# Altium schematic sheet Connectors.SchDoc
size A4; SheetNumber: 1; SheetTotal: 3
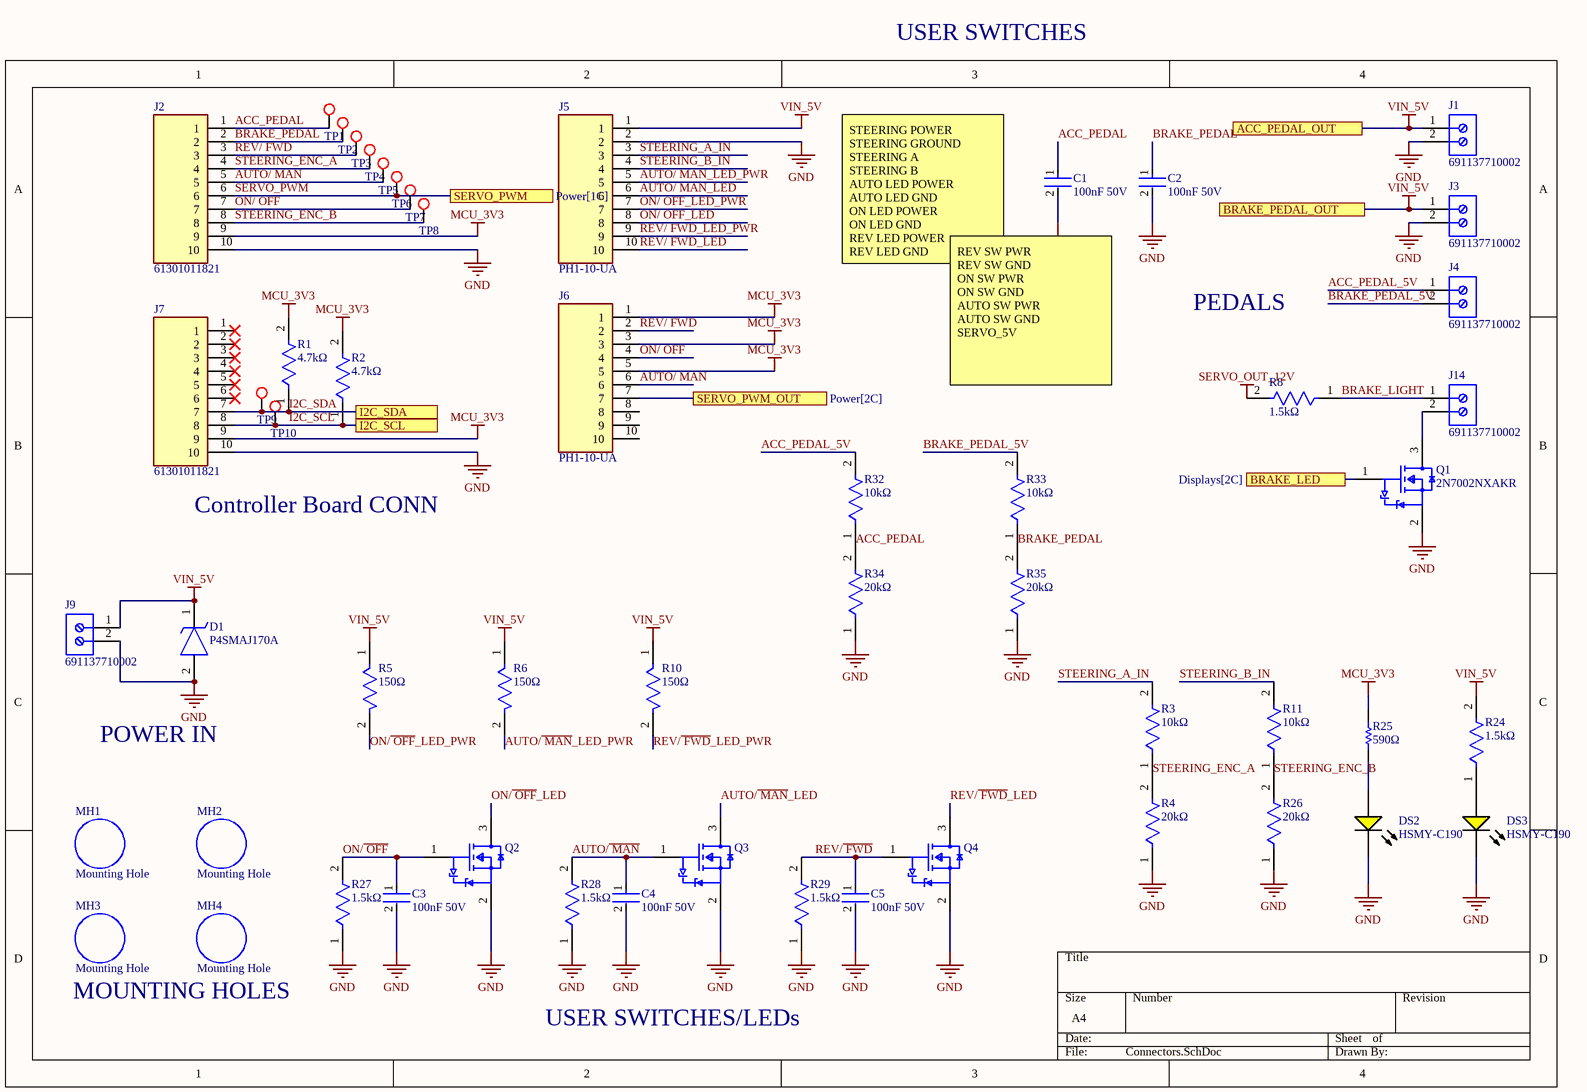
[diagram p0: Connectors.SchDoc]

## Parts
C1  100nF 50V  [FP-CL31-IPC_C]
C2  100nF 50V  [FP-CL31-IPC_C]
C3  100nF 50V  [FP-CL31-IPC_C]
C4  100nF 50V  [FP-CL31-IPC_C]
C5  100nF 50V  [FP-CL31-IPC_C]
D1  P4SMAJ170A  [DIOM5027X240N]
DS2  HSMY-C190  [AVAG-HSMX-C190_V]
DS3  HSMY-C190  [AVAG-HSMX-C190_V]
J1  691137710002  [691137710002]
J2  61301011821  [RHDR10W60P0X254_1X10_2590X250X850P]
J3  691137710002  [691137710002]
J4  691137710002  [691137710002]
J5  PH1-10-UA  [HDRV10W64P0X254_1X10_2540X249X886P]
J6  PH1-10-UA  [HDRV10W64P0X254_1X10_2540X249X886P]
J7  61301011821  [RHDR10W60P0X254_1X10_2590X250X850P]
J9  691137710002  [691137710002]
J14  691137710002  [691137710002]
MH1  Mounting Hole  [Mounting Hole]
MH2  Mounting Hole  [Mounting Hole]
MH3  Mounting Hole  [Mounting Hole]
MH4  Mounting Hole  [Mounting Hole]
Q1  2N7002NXAKR  [FP-SOT23-IPC_B]
Q2  2N7002NXAKR  [FP-SOT23-IPC_B]  (value not drawn)
Q3  2N7002NXAKR  [FP-SOT23-IPC_B]  (value not drawn)
Q4  2N7002NXAKR  [FP-SOT23-IPC_B]  (value not drawn)
R1  4.7kΩ  [FP-RT0805-MFG]
R2  4.7kΩ  [FP-RT0805-MFG]
R3  10kΩ  [FP-RT0603-MFG]
R4  20kΩ  [FP-RT0805-MFG]
R5  150Ω  [FP-RT0603-MFG]
R6  150Ω  [FP-RT0603-MFG]
R8  1.5kΩ  [FP-CRCW0603-e3-IPC_A]  (no BOM)
R10  150Ω  [FP-RT0603-MFG]
R11  10kΩ  [FP-RT0603-MFG]
R24  1.5kΩ  [FP-RC1608-IPC_B]
R25  590Ω  [RESC1608X55X25ML10T15]
R26  20kΩ  [FP-RT0805-MFG]
R27  1.5kΩ  [FP-CRCW0603-e3-IPC_A]
R28  1.5kΩ  [FP-CRCW0603-e3-IPC_A]
R29  1.5kΩ  [FP-CRCW0603-e3-IPC_A]
R32  10kΩ  [FP-RT0603-MFG]
R33  10kΩ  [FP-RT0603-MFG]
R34  20kΩ  [FP-RT0805-MFG]
R35  20kΩ  [FP-RT0805-MFG]
TP1  TP  [Testpoint]  (value not drawn)
TP2  TP  [Testpoint]  (value not drawn)
TP3  TP  [Testpoint]  (value not drawn)
TP4  TP  [Testpoint]  (value not drawn)
TP5  TP  [Testpoint]  (value not drawn)
TP6  TP  [Testpoint]  (value not drawn)
TP7  TP  [Testpoint]  (value not drawn)
TP8  TP  [Testpoint]  (value not drawn)
TP9  TP  [Testpoint]  (value not drawn)
TP10  TP  [Testpoint]  (value not drawn)

## Ports
ACC_PEDAL_OUT, BRAKE_LED (see Displays[2C]), BRAKE_PEDAL_OUT, I2C_SCL (see Displays[1A], Displays[2C]), I2C_SDA (see Displays[1A], Displays[2C]), SERVO_PWM (see Power[1C]), SERVO_PWM_OUT (see Power[2C])

## Nets
GND: C1.2 C2.2 C3.2 C4.2 C5.2 D1.2(A) DS2.2(K) DS3.2(K) J1.2 J2.10 J3.2 J5.2 J7.10 J9.2 Q1.2(S) Q2.2(S) Q3.2(S) Q4.2(S) R4.1 R26.1 R27.1 R28.1 R29.1 R34.1 R35.1
MCU_3V3: J2.9 J6.1 J6.3 J6.5 J7.9 R1.2 R2.2 R25.2
SERVO_OUT_12V: R8.2
VIN_5V: D1.1(K) J1.1 J3.1 J5.1 J9.1 R5.1 R6.1 R10.1 R24.2 ; port ACC_PEDAL_OUT, port BRAKE_PEDAL_OUT
ACC_PEDAL: C1.1 J2.1 R32.1 R34.2 TP1.0
ACC_PEDAL_5V: J4.1 R32.2
AUTO/~{ MAN}: C4.1 J2.5 J6.6 Q3.1(G) R28.2 TP5.0
AUTO/~{ MAN}_LED: J5.6 Q3.3(D)
AUTO/~{ MAN}_LED_PWR: J5.5 R6.2
BRAKE_LED: Q1.1(G) ; port BRAKE_LED
BRAKE_LIGHT: J14.1 R8.1
BRAKE_PEDAL: C2.1 J2.2 R33.1 R35.2 TP2.0
BRAKE_PEDAL_5V: J4.2 R33.2
I2C_SCL: J7.8 R2.1 TP10.0 ; port I2C_SCL
I2C_SDA: J7.7 R1.1 TP9.0 ; port I2C_SDA
ON/~{ OFF}: C3.1 J2.7 J6.4 Q2.1(G) R27.2 TP7.0
ON/~{ OFF}_LED: J5.8 Q2.3(D)
ON/~{ OFF}_LED_PWR: J5.7 R5.2
REV/~{ FWD}: C5.1 J2.3 J6.2 Q4.1(G) R29.2 TP3.0
REV/~{ FWD}_LED: J5.10 Q4.3(D)
REV/~{ FWD}_LED_PWR: J5.9 R10.2
SERVO_PWM: J2.6 TP6.0 ; port SERVO_PWM
SERVO_PWM_OUT: J6.7 ; port SERVO_PWM_OUT
STEERING_A_IN: J5.3 R3.2
STEERING_B_IN: J5.4 R11.2
STEERING_ENC_A: J2.4 R3.1 R4.2 TP4.0
STEERING_ENC_B: J2.8 R11.1 R26.2 TP8.0
NetDS2_1: DS2.1(A) R25.1
NetDS3_1: DS3.1(A) R24.1
NetJ14_2: J14.2 Q1.3(D)

Not connected (* = marked no-connect by the designer): J6 8 9 10; J7 1* 2* 3* 4* 5* 6*

## Notes on the sheet
- USER SWITCHES
- STEERING POWER
  STEERING GROUND
  STEERING A
  STEERING B
  AUTO LED POWER
  AUTO LED GND
  ON LED POWER
  ON LED GND
  REV LED POWER
  REV LED GND
- PEDALS
- REV SW PWR
  REV SW GND
  ON SW PWR
  ON SW GND
  AUTO SW PWR
  AUTO SW GND
  SERVO_5V
- (near J7) Controller Board CONN
- POWER IN
- MOUNTING HOLES
- USER SWITCHES/LEDs

## Library data of the parts
C1-C5 = CMP-13271-001276-1: Cap Ceramic 100nF 50V X7R ±10% SMD 1206 +125°C Embossed T/R; Dielectric: X7R; Case Code (Metric): 3216; Package Quantity: 1; Thickness: 0.037inch; Depth: 1.6mm; Packaging: Tape and Reel; Capacitance: 100nF; Length: 0.126inch; Tolerance: 10%; Voltage Rating: 50V; Case Code (Imperial): 1206; Radiation Hardening: No; Width: 0.063inch; Case/Package: 1206; Max Operating Temperature: 125°C; Min Operating Temperature: -55°C; Height: 0.85mm; Mount: Surface Mount
D1 = P4SMAJ170A: TVS Diode (Uni-directional); Manufacturer_Name: Diotec; Datasheet Link: https://diotec.com/request/datasheet/p4smaj65.pdf; Height: 2.4mm; Manufacturer_Part_Number: P4SMAJ170A
DS2 DS3 = CMP-1744-00003-1: LED Uni-Color Yellow, 65 mW, 20 mA, -40 to 85 degC, 2-Pin SMD, RoHS, Tape and Reel; Tolerance: 1%; Voltage Rating: 50 V; Power Rating: 100 mW; Case\Package: 0603; Resistance: 390 Ohm; Min Operating Temperature: -55 degC; Length: 1.6 mm; ComponentLink3Description: Package Specification; Mount: Surface Mount; PackageReference: HSMX-C190; ComponentLink2Description: Datasheet; DatasheetVersion: Mar-12; Case Code (Metric): 1608; Pins: 2; Package Quantity: 5000; ComponentLink2URL: http://docs.avagotech.com/docs/AV02-0551EN; ComponentLink1Description: Manufacturer URL; RoHSCompliant: true; Packaging: Tape and Reel; PackageDescription: 2-Pin Surface Mount Device, Body 1.6 x 0.8 mm, Height 0.9 mm; REACH SVHC: No SVHC; ComponentLink3URL: http://www.fairchildsemi.com/dwg/MA/MA03D.pdf; Voltage Rating (DC): 50 V; Width: 0.8 mm; ComponentLink1URL: http://www.avagotech.com/; Max Operating Temperature: 155 degC; Case Code (Imperial): 0603; Height: 0.45 mm
J1 J3 J4 J9 J14 = CMP-1502-03324-2: NexarPartId: 78871135; Voltage Rating: 300V; Number of Contacts: 2; Current Rating: 16A; Lead Pitch: 5mm; Height: 11.6mm; Packaging: Box; RoHS: Non-Compliant; Contact Material: Nickel, Tin; Max Operating Temperature: 120°C; Number of Pins: 2; Min Operating Temperature: -30°C; Number of Rows: 1
J2 J7 = 61301011821: Connector; Manufacturer_Name: Wurth Elektronik; Datasheet Link: http://katalog.we-online.de/em/datasheet/6130xx11821.pdf; Height: 8.5mm; Manufacturer_Part_Number: 61301011821; Mouser Part Number: 710-61301011821; Mouser Price/Stock: https://www.mouser.co.uk/ProductDetail/Wurth-Elektronik/61301011821?qs=W%252B2sBeLta1ZhlLR0YCzonQ%3D%3D
J5 J6 = PH1-10-UA: Connector; Manufacturer_Name: Adam Tech; Datasheet Link: https://app.adam-tech.com/products/download/data_sheet/201605/ph1-xx-ua-data-sheet.pdf; Height: 8.865mm; Manufacturer_Part_Number: PH1-10-UA; Mouser Part Number: 737-PH1-10-UA; Mouser Price/Stock: https://www.mouser.co.uk/ProductDetail/Adam-Tech/PH1-10-UA?qs=ogqIPVdloe%252Bff9mnAAAy9w%3D%3D; Arrow Part Number: PH1-10-UA; Arrow Price/Stock: null?utm_currency=USD&region=nac
Q1-Q4 = CMP-14409-000026-2: 2N7002NXAK/SOT23/TO-236AB
R1 R2 = CMP-03412-019393-1: RES SMD 4.7K OHM 1% 1/8W 0805; Manufacturer Part Number: RT0805FRE074K7L; Manufacturer: Yageo; Tolerance: 0.0001; Power Rating: 0.125W; Voltage Rating: 150V; Temperature Coefficient: 50 ppm/°C; Device Class L1: Passive Components; Category: Res; Temperature Range Low: -55°C; Device Class L2: Resistors; Ipc Land Pattern Name: RESC200125X50; Package: RT0805; Device Class L3: Chip SMD Resistors; Temperature: -55°C to +155°C; ComponentLink2Description: Datasheet; Footprint Url: http://www.yageo.com/exep/pages/download/literatures/PYu-R_Mount_10.pdf; Series: RT; Mouser Description: Thin Film Resistors - SMD 1/8W 4.7K ohm 1% 50ppm; Height: 0.6mm; Resistance: 4.7KΩ; Octopart: https://octopart.com/rt0805fre074k7l-yageo-40047233; Value: 4.7KΩ; Digikey Description: RES SMD 4.7K OHM 1% 1/8W 0805; Composition: Thin Film; Automotive: No; Temperature Range High: +155°C; Lead Free: Yes; ComponentLink2URL: http://www.yageo.com/documents/recent/PYu-RT_1-to-0.01_RoHS_L_9.pdf; RoHS: TRUE
R3 R11 R32 R33 = CMP-2000-04517-2: RES SMD 10K OHM 0.1% 1/10W 0603; Manufacturer Part Number: RT0603BRE0710KL; Manufacturer: Yageo; Tolerance: 0.001; Temperature Coefficient: 50 ppm/°C; Power Rating: 0.1W; Voltage Rating: 75V; Temperature Range High: +155°C; Device Class L2: Resistors; Temperature: -55°C to +155°C; Series: RT; Device Class L1: Passive Components; Temperature Range Low: -55°C; Automotive: No; Mouser Description: Res Thin Film 0603 10K Ohm 0.1% 1/10W ±50ppm/°C Molded SMD SMD Paper T/R; Device Class L3: Chip SMD Resistors; RoHS: TRUE; Package: RT0603; Footprint Url: http://www.yageo.com/exep/pages/download/literatures/PYu-R_Mount_10.pdf; Octopart: https://octopart.com/rt0603bre0710kl-yageo-1273959; ComponentLink2URL: http://www.yageo.com/documents/recent/PYu-RT_1-to-0.01_RoHS_L_9.pdf; Composition: Thin Film; Category: Res; Lead Free: Yes; Resistance: 10KΩ; Height: 0.55mm; Digikey Description: RES SMD 10K OHM 0.1% 1/10W 0603; Ipc Land Pattern Name: RESC16080X45; Value: 10KΩ; ComponentLink2Description: Datasheet
R4 R26 R34 R35 = CMP-2001-01463-2: RES SMD 20K OHM 1% 1/8W 0805; Manufacturer: Yageo; Manufacturer Part Number: RT0805FRE0720KL; Power Rating: 0.125W; Voltage Rating: 150V; Tolerance: 0.0001; Temperature Coefficient: 50 ppm/°C; Height: 0.6mm; Lead Free: Yes; Device Class L3: Chip SMD Resistors; Series: RT; ComponentLink2URL: http://www.yageo.com/documents/recent/PYu-RT_1-to-0.01_RoHS_L_9.pdf; Footprint Url: http://www.yageo.com/exep/pages/download/literatures/PYu-R_Mount_10.pdf; Value: 20KΩ; Mouser Description: Thin Film Resistors - SMD 1/8W 20K ohm 1% 50ppm; Device Class L2: Resistors; Device Class L1: Passive Components; RoHS: TRUE; ComponentLink2Description: Datasheet; Category: Res; Package: RT0805; Digikey Description: RES SMD 20K OHM 1% 1/8W 0805; Temperature Range High: +155°C; Ipc Land Pattern Name: RESC200125X50; Temperature Range Low: -55°C; Octopart: https://octopart.com/rt0805fre0720kl-yageo-1410620; Resistance: 20KΩ; Temperature: -55°C to +155°C; Composition: Thin Film; Automotive: No
R5 R6 R10 = CMP-03412-008371-1: RES SMD 150 OHM 1% 1/10W 0603; Manufacturer Part Number: RT0603FRE07150RL; Manufacturer: Yageo; Voltage Rating: 75V; Power Rating: 0.1W; Tolerance: 0.01; Temperature Coefficient: 50 ppm/°C; Digikey Description: RES SMD 150 OHM 1% 1/10W 0603; Device Class L3: Chip SMD Resistors; Category: Res; Automotive: No; Octopart: https://octopart.com/rt0603fre07150rl-yageo-39804552; Ipc Land Pattern Name: RESC16080X45; RoHS: TRUE; Composition: Thin Film; Lead Free: Yes; Temperature: -55°C to +155°C; Footprint Url: http://www.yageo.com/exep/pages/download/literatures/PYu-R_Mount_10.pdf; ComponentLink2URL: http://www.yageo.com/documents/recent/PYu-RT_1-to-0.01_RoHS_L_9.pdf; Device Class L1: Passive Components; ComponentLink2Description: Datasheet; Device Class L2: Resistors; Temperature Range Low: -55°C; Height: 0.55mm; Resistance: 150Ω; Package: RT0603; Series: RT; Temperature Range High: +155°C; Mouser Description: Thin Film Resistors - SMD 1/10W 150 ohm 1% 50ppm; Value: 150Ω
R8 R27-R29 = CMP-2000-02995-2: RES Thick Film, 1.5kΩ, 1%, 0.1W, 100ppm/°C, 0603; Working Voltage: 75V; Power Rating: 100mW; Resistance: 1.5kR; Max Operating Temperature: 155°C; Features: Automotive AEC-Q200; Min Operating Temperature: -55°C; Width: 0.033inch; Case/Package: 0603; Voltage Rating (DC): 75V; Termination: SMD/SMT; Mount: Surface Mount; Weight: 7.1E-05oz; Case Code (Metric): 1608; Height: 0.45mm; Voltage Rating: 75V; Length: 1.55mm; Package Quantity: 10; Lead Free: Lead Free; Composition: Thick Film; Packaging: Tape and Reel; Temperature Coefficient: 100ppm/°C; Tolerance: 1%; Military Standard: Not; Case Code (Imperial): 0603; Number of Terminations: 2; Max Power Dissipation: 100mW; Depth: 0.85mm; Contact Plating: Tin
R24 = CMP-13261-004935-1: Res Thick Film 0603 1.5kΩ 1% 0.1W ±100ppm/°C Molded SMD T/R; Resistance: 1.5kR; Voltage Rating (DC): 50V; Power Rating: 100mW; Contact Plating: Tin; Depth: 0.8mm; Width: 800um; Tolerance: 1%; Lead Free: Lead Free; Composition: Thick Film; Military Standard: Not; Temperature Coefficient: 100ppm/°C; Radiation Hardening: No; Length: 1.6mm; Case/Package: 0603; Max Operating Temperature: 155°C; Packaging: Tape and Reel; Min Operating Temperature: -55°C
R25 = CMP-2000-04089-1: Part Number: RC0603FR-07590RL; Manufacturer: Yageo
TP1-TP10 = Testpoint